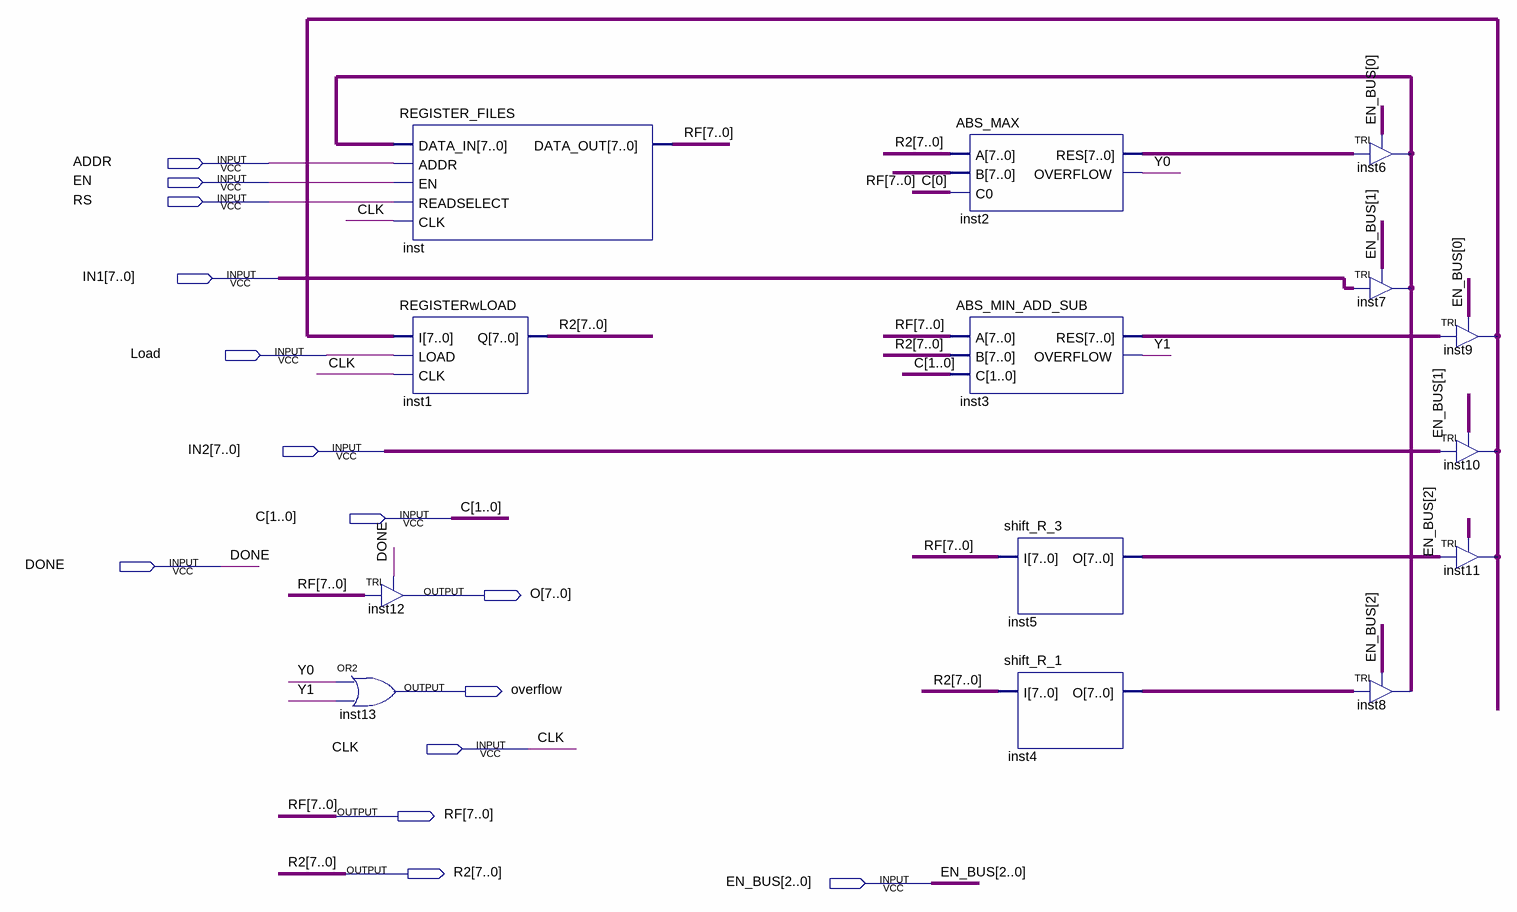
[diagram p0: schematic sheet]
// Quartus schematic DATAPATH_4.bdf as structural Verilog: 14 symbols, 14 pins
module DATAPATH_4 (
  input  ADDR,
  input  EN,
  input  RS,
  input  [7:0] IN1,
  input  Load,
  input  [7:0] IN2,
  input  [1:0] C,
  input  DONE,
  input  CLK,
  input  [2:0] EN_BUS,
  output [7:0] O,
  output overflow,
  output [7:0] RF,
  output [7:0] R2
);

  wire Y0, Y1;
  wire [7:0] inst2_res, inst3_res, inst4_o, inst5_o, inst6_out, inst9_out;

  or inst13 (overflow, Y0, Y1);
  REGISTER_FILES inst (.DATA_IN(inst6_out), .ADDR(ADDR), .EN(EN), .READSELECT(RS), .CLK(CLK), .DATA_OUT(RF));
  REGISTERwLOAD inst1 (.I(inst9_out), .LOAD(Load), .CLK(CLK), .Q(R2));
  TRI inst12[7:0] (.IN(RF), .OE(DONE), .OUT(O));
  ABS_MAX inst2 (.A(R2), .B(RF), .C0(C[0]), .RES(inst2_res), .OVERFLOW(Y0));
  ABS_MIN_ADD_SUB inst3 (.A(RF), .B(R2), .C(C), .RES(inst3_res), .OVERFLOW(Y1));
  shift_R_3 inst5 (.I(RF), .O(inst5_o));
  shift_R_1 inst4 (.I(R2), .O(inst4_o));
  TRI inst6[7:0] (.IN(inst2_res), .OE(EN_BUS[0]), .OUT(inst6_out));
  TRI inst7[7:0] (.IN(IN1), .OE(EN_BUS[1]), .OUT(inst6_out));
  TRI inst8[7:0] (.IN(inst4_o), .OE(EN_BUS[2]), .OUT(inst6_out));
  TRI inst9[7:0] (.IN(inst3_res), .OE(EN_BUS[0]), .OUT(inst9_out));
  TRI inst10[7:0] (.IN(IN2), .OE(EN_BUS[1]), .OUT(inst9_out));
  TRI inst11[7:0] (.IN(inst5_o), .OE(EN_BUS[2]), .OUT(inst9_out));
endmodule
